# EAGLE design Shruthi-Digital-v01_165 (EAGLE 5.06)
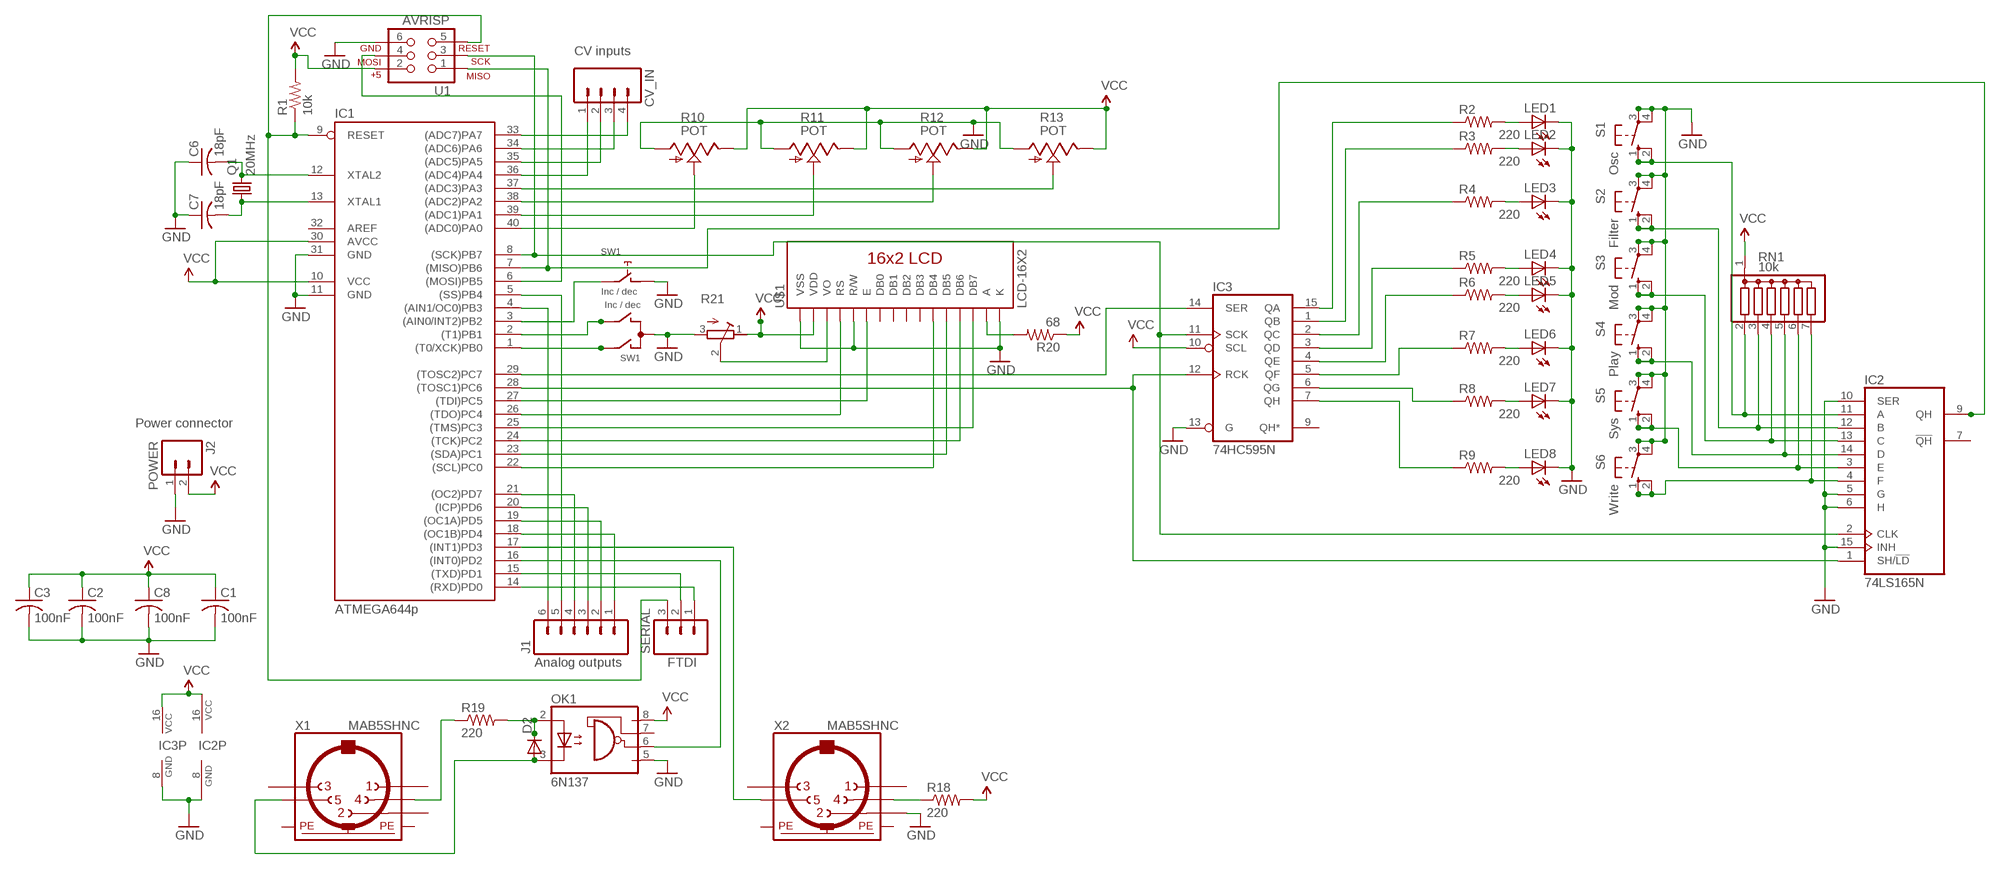
[diagram p0: schematic, sheet 1]

## Parts
C1  100nF  C-US025-024X044  [C025-024X044]
C2  100nF  C-US025-024X044  [C025-024X044]
C3  100nF  C-US025-024X044  [C025-024X044]
C6  18pF  C-US025-024X044  [C025-024X044]
C7  18pF  C-US025-024X044  [C025-024X044]
C8  100nF  C-US025-024X044  [C025-024X044]
CV_IN  M04PTH  [1X04]
D2  1n4148  DIODE1N4148  [DIODE-1N4148]
IC1  ATMEGA644p  MEGA16-P  [DIL40]
IC2  74LS165N  [DIL16]
IC3  74HC595N  [DIL16]
J1  M06SIP  [1X06]
J2  POWER  M02PTH  [1X02]
LED1  LED3MM  [LED3MM]
LED2  LED3MM  [LED3MM]
LED3  LED3MM  [LED3MM]
LED4  LED3MM  [LED3MM]
LED5  LED3MM  [LED3MM]
LED6  LED3MM  [LED3MM]
LED7  LED3MM  [LED3MM]
LED8  LED3MM  [LED3MM]
OK1  6N137  [DIL08]
Q1  20MHz  CRYSTALHC49U-V  [HC49U-V]
R1  10k  R-US_0204/7  [0204/7]
R2  220  R-US_0204/7  [0204/7]
R3  220  R-US_0204/7  [0204/7]
R4  220  R-US_0204/7  [0204/7]
R5  220  R-US_0204/7  [0204/7]
R6  220  R-US_0204/7  [0204/7]
R7  220  R-US_0204/7  [0204/7]
R8  220  R-US_0204/7  [0204/7]
R9  220  R-US_0204/7  [0204/7]
R10  POT  POT_US  [ALPS_POT_SFE]
R11  POT  POT_US  [ALPS_POT_SFE]
R12  POT  POT_US  [ALPS_POT_SFE]
R13  POT  POT_US  [ALPS_POT_SFE]
R18  220  R-US_0204/7  [0204/7]
R19  220  R-US_0204/7  [0204/7]
R20  68  R-US_0204/7  [0204/7]
R21  R-TRIMMT93YA  [RTRIMT93YA]
RN1  10k  G06R  [SIL7]
S1  Osc  40-XX  [B3F-40XX]
S2  Filter  40-XX  [B3F-40XX]
S3  Mod  40-XX  [B3F-40XX]
S4  Play  40-XX  [B3F-40XX]
S5  Sys  40-XX  [B3F-40XX]
S6  Write  40-XX  [B3F-40XX]
SERIAL  M03LOCK  [1X03_LOCK]
SW1  Inc / dec  EC12E_SW  [ALPS_EC12E_SW]
U1  AVRISP  AVR_SPI_PRG_6PTH  [2X3]
U$1  LCD-16X2  [LCD-16X2]
X1  MAB5SHNC  [MAB5SH-NC]
X2  MAB5SHNC  [MAB5SH-NC]

## Nets
GND: C1.2 C2.2 C3.2 C6.1 C7.1 C8.2 IC1.11(GND) IC1.31(GND) IC2.5(G) IC2.6(H) IC2.8(GND) IC2.10(SER) IC2.15(INH) IC3.8(GND) IC3.13(G) J2.1 LED1.K(C) LED2.K(C) LED3.K(C) LED4.K(C) LED5.K(C) LED6.K(C) LED7.K(C) LED8.K(C) OK1.5(GND) R10.P$3(A) R11.P$3(A) R12.P$3(A) R13.P$3(A) R21.3(E) S1.3(P) S1.4(P1) S2.3(P) S2.4(P1) S3.3(P) S3.4(P1) S4.3(P) S4.4(P1) S5.3(P) S5.4(P1) S6.3(P) S6.4(P1) SW1.C SW1.D U1.6 U$1.1(VSS) U$1.5(R/W) U$1.16(K) X2.2
N$1: IC3.2(QC) R4.1
N$3: IC2.4(F) RN1.7 S6.1(S) S6.2(S1)
N$6: IC1.9(RESET) R1.1 SERIAL.3 U1.5
N$8: IC1.8((SCK)PB7) IC2.2(CLK) IC3.11(SCK) U1.3
N$9: IC1.7((MISO)PB6) IC2.9(QH) U1.1
N$10: CV_IN.1 IC1.36((ADC4)PA4)
N$11: CV_IN.2 IC1.35((ADC5)PA5)
N$12: CV_IN.3 IC1.34((ADC6)PA6)
N$13: CV_IN.4 IC1.33((ADC7)PA7)
N$14: IC1.40((ADC0)PA0) R10.P$2(S)
N$15: IC1.39((ADC1)PA1) R11.P$2(S)
N$16: IC1.38((ADC2)PA2) R12.P$2(S)
N$17: IC1.37((ADC3)PA3) R13.P$2(S)
N$18: IC1.4((AIN1/OC0)PB3) J1.6
N$19: IC1.5((SS)PB4) J1.5
N$20: IC1.18((OC1B)PD4) J1.1
N$21: IC1.19((OC1A)PD5) J1.2
N$22: IC1.20((ICP)PD6) J1.3
N$23: IC1.21((OC2)PD7) J1.4
N$24: IC1.14((RXD)PD0) SERIAL.1
N$25: IC1.15((TXD)PD1) SERIAL.2
N$26: IC1.22((SCL)PC0) U$1.11(DB4)
N$27: IC1.26((TDO)PC4) U$1.4(RS)
N$29: IC1.28((TOSC1)PC6) IC2.1(SH/!LD) IC3.12(RCK)
N$30: IC3.15(QA) R2.1
N$31: IC3.1(QB) R3.1
N$33: IC3.3(QD) R5.1
N$34: IC3.4(QE) R6.1
N$35: IC3.5(QF) R7.1
N$36: IC3.7(QH) R9.1
N$37: IC3.6(QG) R8.1
N$42: LED1.A R2.2
N$43: LED2.A R3.2
N$44: LED3.A R4.2
N$45: LED4.A R5.2
N$46: LED5.A R6.2
N$47: LED6.A R7.2
N$48: LED7.A R8.2
N$49: LED8.A R9.2
N$57: IC1.6((MOSI)PB5) U1.4
N$58: IC1.29((TOSC2)PC7) IC3.14(SER)
N$59: IC2.11(A) RN1.2 S1.1(S) S1.2(S1)
N$60: IC2.12(B) RN1.3 S2.1(S) S2.2(S1)
N$61: IC2.13(C) RN1.4 S3.1(S) S3.2(S1)
N$62: IC2.14(D) RN1.5 S4.1(S) S4.2(S1)
N$63: IC2.3(E) RN1.6 S5.1(S) S5.2(S1)
N$64: IC1.1((T0/XCK)PB0) SW1.A
N$65: IC1.2((T1)PB1) SW1.B
N$66: IC1.3((AIN0/INT2)PB2) SW1.E
N$67: D2.C OK1.2(A) R19.2
N$68: R18.1 X2.4
N$69: IC1.17((INT1)PD3) X2.5
N$70: IC1.16((INT0)PD2) OK1.6(VO)
N$71: IC1.23((SDA)PC1) U$1.12(DB5)
N$72: R19.1 X1.4
N$73: D2.A OK1.3(C) X1.5
N$74: IC1.24((TCK)PC2) U$1.13(DB6)
N$75: IC1.25((TMS)PC3) U$1.14(DB7)
N$76: IC1.27((TDI)PC5) U$1.6(E)
N$78: R21.2(S) U$1.3(VO)
N$79: R20.2 U$1.15(A)
N$82: C7.2 IC1.13(XTAL1) Q1.1
N$83: C6.2 IC1.12(XTAL2) Q1.2
VCC: C1.1 C2.1 C3.1 C8.1 IC1.10(VCC) IC1.30(AVCC) IC2.16(VCC) IC3.10(SCL) IC3.16(VCC) J2.2 OK1.8(VCC) R1.2 R10.P$1(E) R11.P$1(E) R12.P$1(E) R13.P$1(E) R18.2 R20.1 R21.1(A) RN1.1 U1.2 U$1.2(VDD)
Unconnected: IC1.32(AREF) IC2.7(!QH) IC3.9(QH*) OK1.7(VE) SW1.GND1(G) SW1.GND2(G) U$1.7(DB0) U$1.8(DB1) U$1.9(DB2) U$1.10(DB3) X1.1 X1.2 X1.3 X2.1 X2.3

## Notes on the sheet
- CV inputs
- Power connector
- Analog outputs | FTDI

## Power pins joined to a net without a drawn wire
PE: X1.PE X1.PE@(PE) X2.PE X2.PE@(PE)

## Library data of the parts
C1-C3 C6-C8 = rcl:C-US: CAPACITOR, American symbol
CV_IN = SparkFun:M04: Header 4 Standard 4-pin 0.1" header. Use with straight break away headers (SKU : PRT-00116), right angle break away headers (PRT-00553), swiss pins (PRT-00743), machine pins (PRT-00117), and female headers (PRT-00115). Molex polarized connector foot print use with SKU : PRT-08231 with associated crimp pins and housings.
D2 = SparkFun:DIODE: Diode These are standard reverse protection diodes and small signal diodes. SMA package can handle up to about 1A. SOD-323 can handle about 200mA. What the SOD-323 package when ordering, there are some mfgs out there that are 5-pin packages.
IC1 = atmel:MEGA16-P: MICROCONTROLLER 16 Kbytes FLASH 1 kbytes SRAM 512 bytes EEPROM USART 8-channel 10 bit ADC Source: avr.lbr
IC2 = 74xx-us:74*165: 8-bit parallel load SHIFT REGISTER
IC3 = 74xx-eu:74*595: 8-bit SHIFT REGISTER, output latch
J1 = SparkFun:M06: Header 6 Standard 6-pin 0.1" header. Use with straight break away headers (SKU : PRT-00116), right angle break away headers (PRT-00553), swiss pins (PRT-00743), machine pins (PRT-00117), and female headers (PRT-00115). Molex polarized connector foot print use with SKU : PRT-08094 with associated crimp pins and housings. NOTES ON THE VARIANTS LOCK and LOCK_LONGPADS... This footprint was designed to help hold the alignment of a through-hole component (i.e. 6-pin header) while soldering it into place. You may notice that each hole has been shifted either up or down by 0.005 of an inch from it's more standard position (which is a perfectly straight line). This slight alteration caused the pins (the squares in the middle) to touch the edges of the holes. Because they are alternating, it causes a "brace" to hold the component in place. 0.005 has proven to be the perfect amount of "off-center" position when using our standard breakaway headers. Although looks a little odd when you look at the bare footprint, once you have a header in there, the alteration is very hard to notice. Also, if you push a header all the way into place, it is covered up entirely on the bottom side. This idea of altering the position of holes to aid alignment will be further integrated into the Sparkfun Library for other footprints. It can help hold any component with 3 or more connection pins.
J2 = SparkFun:M02: Header 2 Standard 2-pin 0.1" header. Use with straight break away headers (SKU : PRT-00116), right angle break away headers (PRT-00553), swiss pins (PRT-00743), machine pins (PRT-00117), and female headers (PRT-00115). Molex polarized connector foot print use with SKU : PRT-08233 with associated crimp pins and housings.
LED1-LED8 = led:LED: LED OSRAM: - CHIPLED LG R971, LG N971, LY N971, LG Q971, LY Q971, LO R971, LY R971 LH N974, LH R974 LS Q976, LO Q976, LY Q976 LO Q996 - Hyper CHIPLED LW Q18S LB Q993, LB Q99A, LB R99A - SideLED LS A670, LO A670, LY A670, LG A670, LP A670 LB A673, LV A673, LT A673, LW A673 LH A674 LY A675 LS A676, LA A676, LO A676, LY A676, LW A676 LS A679, LY A679, LG A679 - Hyper Micro SIDELED® LS Y876, LA Y876, LO Y876, LY Y876 LT Y87S - SmartLED LW L88C, LW L88S LB L89C, LB L89S, LG L890 LS L89K, LO L89K, LY L89K LS L896, LA L896, LO L896, LY L896 - TOPLED LS T670, LO T670, LY T670, LG T670, LP T670 LSG T670, LSP T670, LSY T670, LOP T670, LYG T670 LG T671, LOG T671, LSG T671 LB T673, LV T673, LT T673, LW T673 LH T674 LS T676, LA T676, LO T676, LY T676, LB T676, LH T676, LSB T676, LW T676 LB T67C, LV T67C, LT T67C, LS T67K, LO T67K, LY T67K, LW E67C LS E67B, LA E67B, LO E67B, LY E67B, LB E67C, LV E67C, LT E67C LW T67C LS T679, LY T679, LG T679 LS T770, LO T770, LY T770, LG T770, LP T770 LB T773, LV T773, LT T773, LW T773 LH T774 LS E675, LA E675, LY E675, LS T675 LS T776, LA T776, LO T776, LY T776, LB T776 LHGB T686 LT T68C, LB T68C - Hyper Mini TOPLED® LB M676 - Mini TOPLED Santana® LG M470 LS M47K, LO M47K, LY M47K Source: http://www.osram.convergy.de LUXEON: - LUMILED® LXK2-PW12-R00, LXK2-PW12-S00, LXK2-PW14-U00, LXK2-PW14-V00 LXK2-PM12-R00, LXK2-PM12-S00, LXK2-PM14-U00 LXK2-PE12-Q00, LXK2-PE12-R00, LXK2-PE12-S00, LXK2-PE14-T00, LXK2-PE14-U00 LXK2-PB12-K00, LXK2-PB12-L00, LXK2-PB12-M00, LXK2-PB14-N00, LXK2-PB14-P00, LXK2-PB14-Q00 LXK2-PR12-L00, LXK2-PR12-M00, LXK2-PR14-Q00, LXK2-PR14-R00 LXK2-PD12-Q00, LXK2-PD12-R00, LXK2-PD12-S00 LXK2-PH12-R00, LXK2-PH12-S00 LXK2-PL12-P00, LXK2-PL12-Q00, LXK2-PL12-R00 Source: www.luxeon.com KINGBRIGHT: KA-3528ASYC Source: www.kingbright.com
OK1 = optocoupler:6N137: MOTOROLA OPTO COUPLER
Q1 = crystal:CRYSTAL: CRYSTAL
R1-R9 R18-R20 = rcl:R-US_: RESISTOR, American symbol
R10-R13 = pot-alps:POT_US
R21 = rcl:R-TRIMM: Trimm resistor
RN1 = resistor-sil:G06R: SIL RESISTOR
S1-S6 = switch-omron:40-XX: OMRON SWITCH
SERIAL = SparkFun:M03: Header 3 Standard 3-pin 0.1" header. Use with straight break away headers (SKU : PRT-00116), right angle break away headers (PRT-00553), swiss pins (PRT-00743), machine pins (PRT-00117), and female headers (PRT-00115). Molex polarized connector foot print use with SKU : PRT-08232 with associated crimp pins and housings.
SW1 = switch-alps:EC12E_SW: ALPS rotary Encoder EC12E series with switch
U1 = SparkFun:AVR_SPI_PRG_6: AVR ISP 6 Pin This is the reduced ISP connector for AVR programming. Common on Arduino. This footprint will take up less PCB space and can be used with a 10-pin to 6-pin adapter such as SKU: BOB-08508
U$1 = SparkFun:LCD-16X2
X1 X2 = con-hirschmann:MAB5SH: Female CONNECTOR 5 pins 90 deg. with shield, horizontal (DIN 41524)

## Board
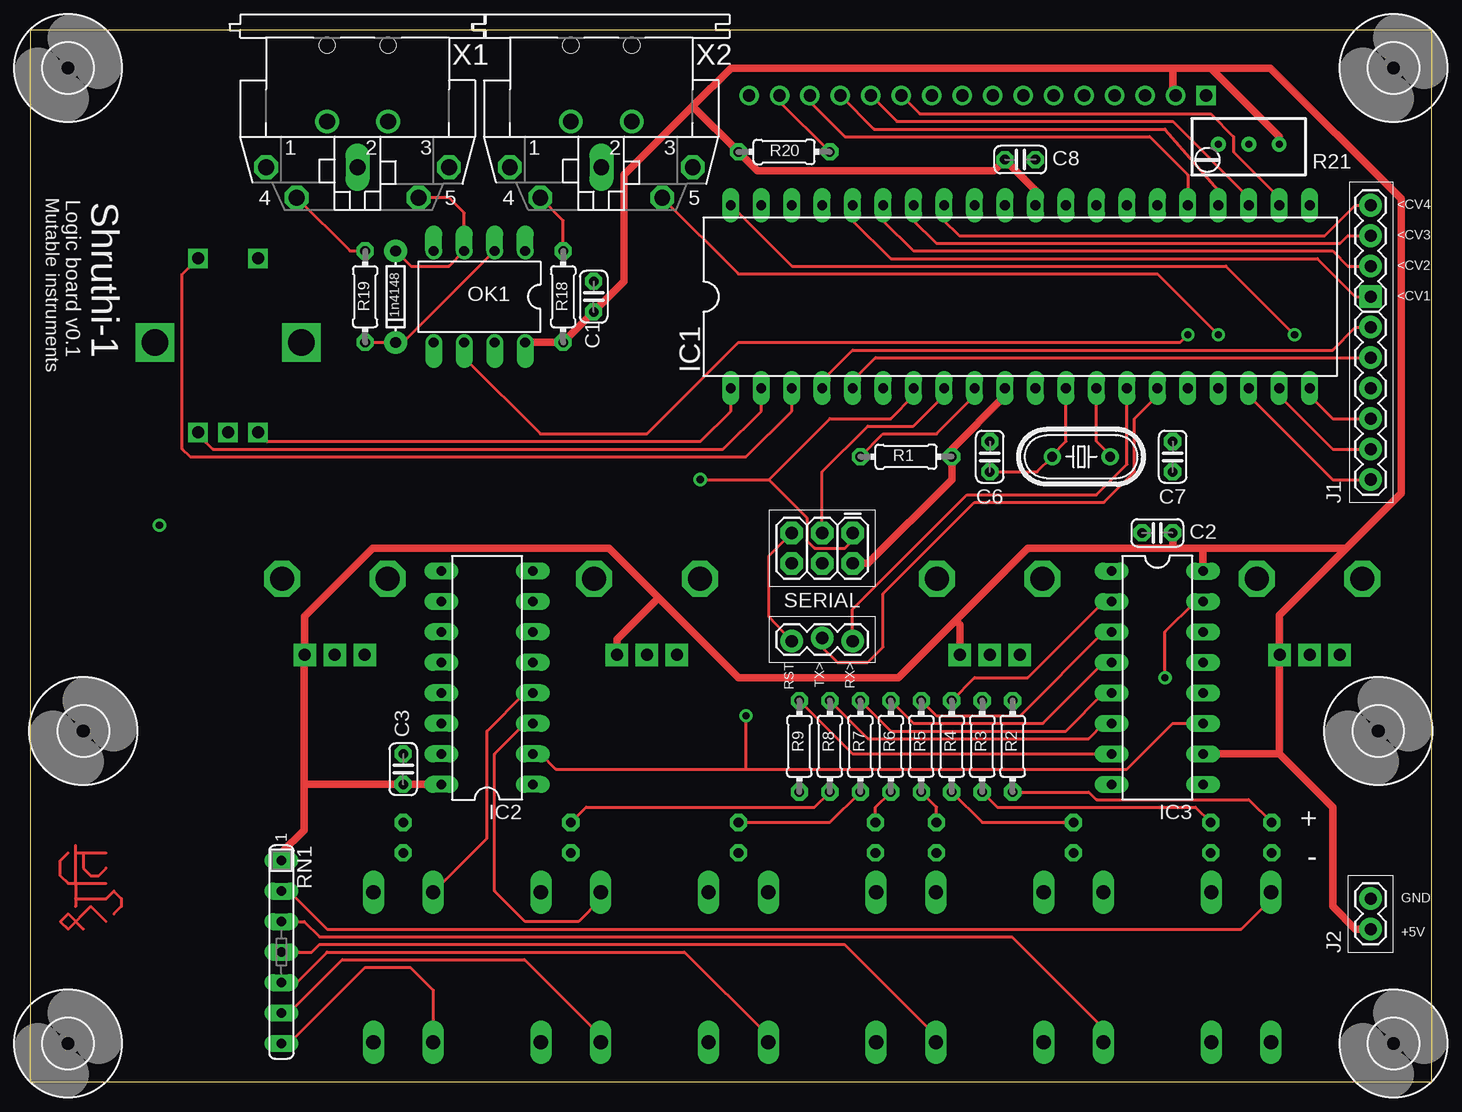
[diagram p1: board, top side]
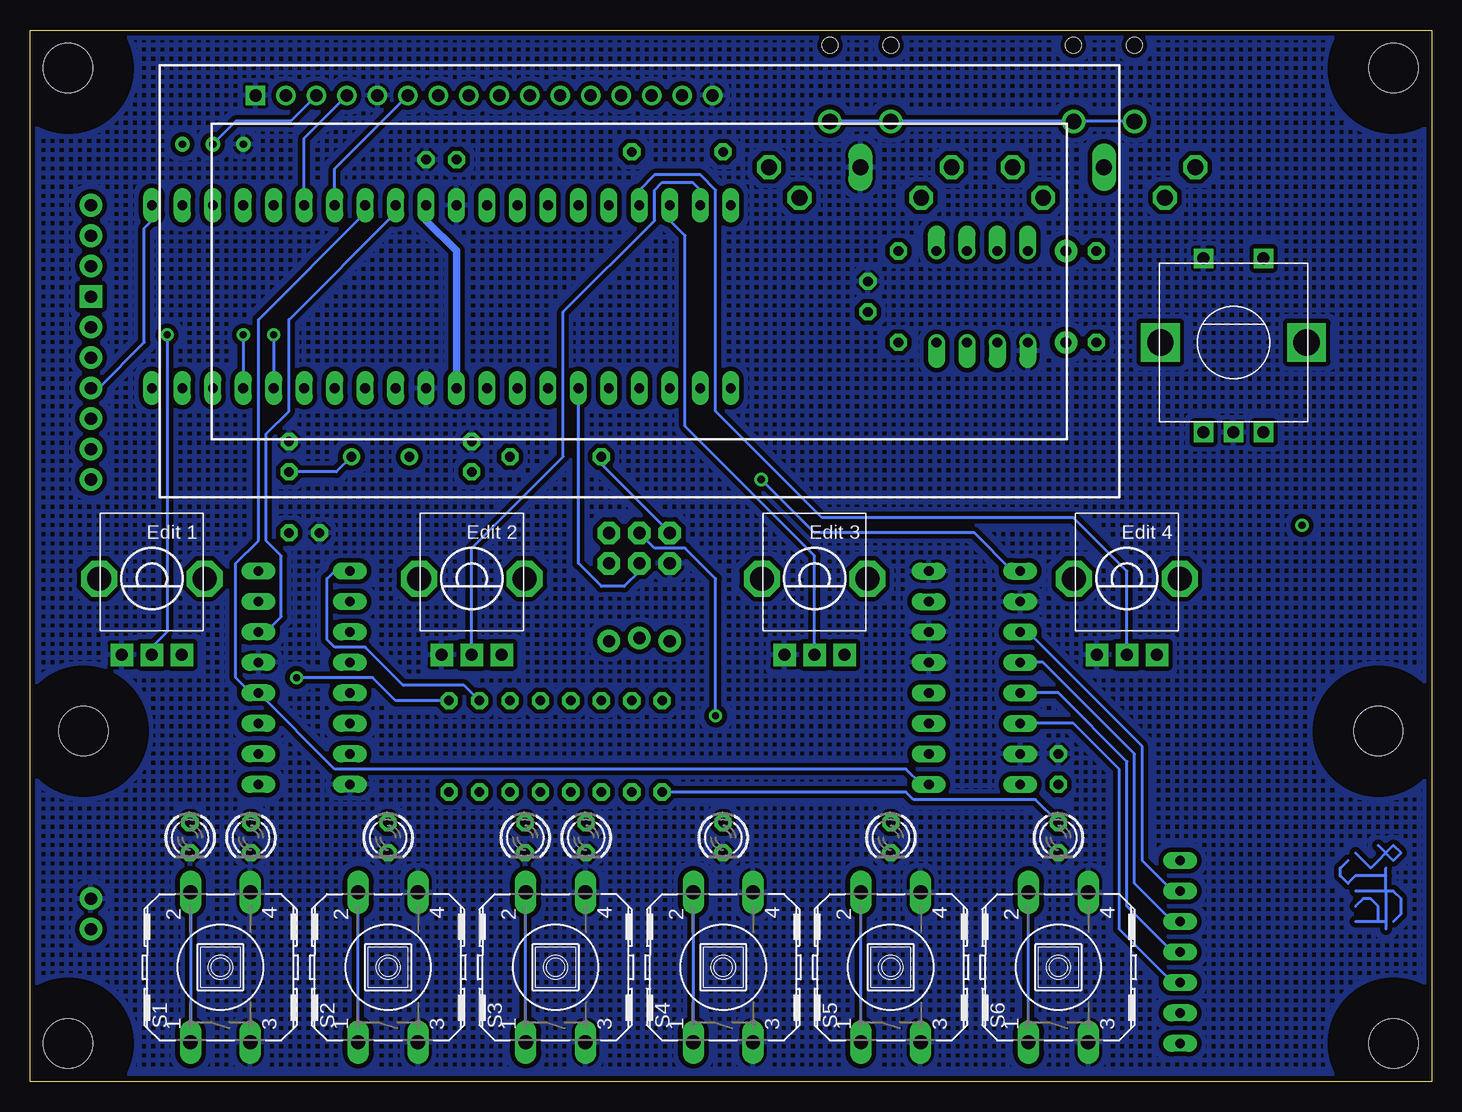
[diagram p2: board, bottom side, seen from below]

Size 116.84 x 87.63 mm. Coordinates in mm from the lower left corner, seen from the top.
Outline: 0,0 116.84,0 116.84,87.63 0,87.62 0,0
Copper layers (1*16): Top 0.035mm / dielectric 1.5mm / Bottom 0.035mm
Design rules "SparkFun": minimum track width 8mil, minimum drill 20mil, track to track 8mil, track to pad 8mil, pad to pad 8mil, via to via 8mil, smd to smd 8mil, copper to edge 10mil, drill to drill 8mil, minimum pad ring 12mil, minimum via ring 10mil, stop-mask expansion 4mil, vias tented up to drill 25mil, thermal gap 10mil

### Footprints (pad centres in the part's own frame; a part is rotated, then mirrored left to right if it is on the bottom)
C025-024X044 = drill 0.813 octagon: 1 -1.27,0; 2 1.27,0
1X04 = drill 1.016 pad 1.88 square: 1 0,0 | drill 1.016 pad 1.88 round: 2 2.54,0; 3 5.08,0; 4 7.62,0
DIODE-1N4148 = drill 0.9 pad 1.88 round: A -3.81,0; C 3.81,0
DIL40 = drill 0.813 long: 1 -24.13,-7.62; 2 -21.59,-7.62; 3 -19.05,-7.62; 4 -16.51,-7.62; 5 -13.97,-7.62; 6 -11.43,-7.62; 7 -8.89,-7.62; 8 -6.35,-7.62; 9 -3.81,-7.62; 10 -1.27,-7.62; 11 1.27,-7.62; 12 3.81,-7.62; 13 6.35,-7.62; 14 8.89,-7.62; 15 11.43,-7.62; 16 13.97,-7.62; 17 16.51,-7.62; 18 19.05,-7.62; 19 21.59,-7.62; 20 24.13,-7.62; 21 24.13,7.62; 22 21.59,7.62; 23 19.05,7.62; 24 16.51,7.62; 25 13.97,7.62; 26 11.43,7.62; 27 8.89,7.62; 28 6.35,7.62; 29 3.81,7.62; 30 1.27,7.62; 31 -1.27,7.62; 32 -3.81,7.62; 33 -6.35,7.62; 34 -8.89,7.62; 35 -11.43,7.62; 36 -13.97,7.62; 37 -16.51,7.62; 38 -19.05,7.62; 39 -21.59,7.62; 40 -24.13,7.62
DIL16 = drill 0.813 long: 1 -8.89,-3.81; 2 -6.35,-3.81; 3 -3.81,-3.81; 4 -1.27,-3.81; 5 1.27,-3.81; 6 3.81,-3.81; 7 6.35,-3.81; 8 8.89,-3.81; 9 8.89,3.81; 10 6.35,3.81; 11 3.81,3.81; 12 1.27,3.81; 13 -1.27,3.81; 14 -3.81,3.81; 15 -6.35,3.81; 16 -8.89,3.81
1X06 = drill 1.016 pad 1.88 round: 1 0,0; 2 2.54,0; 3 5.08,0; 4 7.62,0; 5 10.16,0; 6 12.7,0
1X02 = drill 1.016 pad 1.88 round: 1 0,0; 2 2.54,0
LED3MM = drill 0.813 octagon: A -1.27,0; K 1.27,0
DIL08 = drill 0.813 offset: 1 -3.81,-3.81; 2 -1.27,-3.81; 3 1.27,-3.81; 4 3.81,-3.81; 5 3.81,3.81; 6 1.27,3.81; 7 -1.27,3.81; 8 -3.81,3.81
HC49U-V = drill 0.813 round: 1 -2.413,0; 2 2.413,0
0204/7 = drill 0.813 octagon: 1 -3.81,0; 2 3.81,0
ALPS_POT_SFE = drill 1 pad 1.88 square: P$1 -2.5,6.35; P$2 0,6.35; P$3 2.5,6.35 | drill 2 octagon: P$4 -4.4,0; P$5 4.4,0
RTRIMT93YA = drill 0.61 round: 1 0,-2.54; 2 0,0; 3 0,2.54
SIL7 = drill 0.813 long: 1 -7.62,0; 2 -5.08,0; 3 -2.54,0; 4 0,0; 5 2.54,0; 6 5.08,0; 7 7.62,0
B3F-40XX = drill 1.194 long: 1 -6.248,2.489; 2 6.248,2.489; 3 -6.248,-2.489; 4 6.248,-2.489
1X03_LOCK = drill 1.016 pad 1.88 round: 1 0,0.127; 2 2.54,-0.127; 3 5.08,0.127
ALPS_EC12E_SW = drill 1 square: A -2.5,-7.5; B 2.5,-7.5; C 0,-7.5; D -2.5,7; E 2.5,7 | drill 2.2 square: GND1 -6.1,0; GND2 6.1,0
2X3 = drill 1.016 pad 1.88 octagon: 1 0,0; 2 0,2.54; 3 2.54,0; 4 2.54,2.54; 5 5.08,0; 6 5.08,2.54
LCD-16X2 = drill 1.016 square: 1 -32,15.5 | drill 1.016 round: 2 -29.46,15.5; 3 -26.92,15.5; 4 -24.38,15.5; 5 -21.84,15.5; 6 -19.3,15.5; 7 -16.76,15.5; 8 -14.22,15.5; 9 -11.68,15.5; 10 -9.14,15.5; 11 -6.6,15.5; 12 -4.06,15.5; 13 -1.52,15.5; 14 1.02,15.5; 15 3.56,15.5; 16 6.1,15.5
4,1 = hole 4.1: 0,0
MAB5SH-NC = drill 1.321 octagon: 1 7.62,7.62; 3 -7.62,7.62; 4 5.08,10.16; 5 -5.08,10.16 | drill 1.321 long: 2 0,7.62 | drill 1.321 round: PE -2.54,3.81; PE@ 2.54,3.81 | hole 1.321: -2.54,-2.54; 2.54,-2.54

### Placement (x,y rotation side)
C1  46.99,65.41 90 top
C2  93.98,45.72 180 top
C3  31.11,26.04 90 top
C6  80.01,52.07 270 top
C7  95.25,52.07 270 top
C8  82.55,76.84 0 top
CV_IN  111.76,65.41 90 top
D2  30.48,65.41 270 top
IC1  82.55,65.41 0 top
IC2  38.1,33.66 90 top
IC3  93.98,33.66 270 top
J1  111.76,50.16 90 top
J2  111.76,15.24 270 top
LED1  103.5,20.32 270 bottom
LED2  98.42,20.32 270 bottom
LED3  86.99,20.32 270 bottom
LED4  75.56,20.32 270 bottom
LED5  70.48,20.32 270 bottom
LED6  59.06,20.32 270 bottom
LED7  45.08,20.32 270 bottom
LED8  31.11,20.32 270 bottom
OK1  37.47,65.41 180 top
Q1  87.63,52.07 180 top
R1  73.03,52.07 0 top
R2  81.91,27.94 270 top
R3  79.38,27.94 270 top
R4  76.83,27.94 270 top
R5  74.3,27.94 270 top
R6  71.75,27.94 270 top
R7  69.22,27.94 270 top
R8  66.67,27.94 270 top
R9  64.14,27.94 270 top
R10  106.68,41.91 180 bottom
R11  80.01,41.91 180 bottom
R12  51.44,41.91 180 bottom
R13  25.4,41.91 180 bottom
R18  44.45,65.41 270 top
R19  27.94,65.41 270 top
R20  62.86,77.47 0 top
R21  101.6,78.11 90 top
RN1  20.95,10.8 270 top
S1  100.97,9.53 90 bottom
S2  86.99,9.53 90 bottom
S3  73.03,9.53 90 bottom
S4  59.06,9.53 90 bottom
S5  45.08,9.53 90 bottom
S6  31.11,9.53 90 bottom
SERIAL  68.58,36.83 180 top
SW1  16.51,61.59 0 bottom
U1  68.58,45.72 180 top
U$1  66.04,66.68 0 bottom
U$2  [4,1]  113.66,84.46 0 top
U$3  [4,1]  113.66,3.17 0 top
U$4  [4,1]  3.17,3.17 0 top
U$5  [4,1]  3.17,84.46 0 top
U$6  [4,1]  4.45,29.21 0 top
U$7  [4,1]  112.39,29.21 0 top
X1  27.3,83.82 180 top
X2  47.62,83.82 180 top

### Tracks (layer width: path | path; a pad name or v marks a point on that pad's centre or on a via)
GND
  pour Bottom (isolate 0.381, hatched): 0.63,87 0.63,0.64 116.2,0.64 116.2,87
N$1
  Top 0.254: IC3.2 89.53,40.01 83.19,33.66 78.74,33.66 R4.1
N$3
  Top 0.254: RN1.7 21.59,3.17 27.94,9.53 31.7,9.53 33.6,7.62 S6.1 | IC2.4 41.27,32.38 38.1,29.21 38.1,20.27 S6.2
  Bottom 0.254: S6.1 S6.2
N$4
  Bottom 0.254: 6.35,19.05 5.08,17.78 3.17,19.68 2.54,19.05 3.17,18.41 4.45,19.68
N$6
  Top 0.254: U1.5 61.59,43.81 61.59,38.73 SERIAL.3 | R1.1 71.12,53.98 75.56,53.98 78.74,57.15 IC1.9
  Bottom 0.254: U1.5 69.22,51.44 R1.1
N$8  (via drill 0.6)
  Top 0.254: U1.3 66.04,50.8 69.85,54.61 73.66,54.61 76.2,57.15 IC1.8 | IC3.11 95.25,29.84 91.44,26.04 59.69,26.04 | 59.69,26.04 43.81,26.04 42.55,27.3 IC2.2 | 59.69,26.04 v59.69,30.48
  Bottom 0.254: U1.3 64.77,44.45 62.23,44.45 59.69,41.91 v59.69,30.48
N$9  (via drill 0.6)
  Top 0.254: 61.59,50.16 64.77,46.99 64.77,45.09 65.41,44.45 67.94,44.45 68.58,45.09 U1.1 | IC1.7 73.66,57.15 71.75,55.24 66.67,55.24 61.59,50.16 | v55.88,50.16 61.59,50.16
  Bottom 0.254: IC2.9 34.92,42.55 38.1,45.72 51.44,45.72 v55.88,50.16
N$10
  Top 0.254: IC1.36 68.58,71.76 71.75,68.58 107.31,68.58 110.49,65.41 CV_IN.1
N$11
  Top 0.254: IC1.35 71.12,71.76 73.66,69.22 108.58,69.22 109.85,67.95 CV_IN.2
N$12
  Top 0.254: IC1.34 73.66,71.76 75.56,69.85 109.22,69.85 109.85,70.48 CV_IN.3
N$13
  Top 0.254: IC1.33 76.2,71.76 77.47,70.48 107.95,70.48 110.49,73.03 CV_IN.4
N$14  (via drill 0.6)
  Top 0.254: IC1.40 63.5,67.95 99.69,67.95 v105.41,62.23
  Bottom 0.254: v105.41,62.23 105.41,37.46 106.68,36.2 R10.P$2
N$15
  Bottom 0.254: IC1.39 60.96,74.3 61.59,74.93 64.14,74.93 64.77,74.3 64.77,71.76 72.39,64.14 72.39,52.07 80.01,44.45 R11.P$2
N$16
  Bottom 0.254: IC1.38 63.5,71.76 62.23,70.48 62.23,54.61 51.44,43.81 R12.P$2
N$17
  Bottom 0.254: R13.P$2 25.4,42.55 29.84,46.99 50.8,46.99 59.69,55.88 59.69,74.3 60.96,75.57 64.77,75.57 66.04,74.3 IC1.37
N$18
  Top 0.254: IC1.4 66.04,58.42 68.58,60.96 108.58,60.96 110.49,62.87 J1.6
N$19
  Top 0.254: IC1.5 68.58,58.42 70.48,60.32 J1.5
N$20
  Top 0.254: IC1.18 101.6,57.15 108.58,50.16 J1.1
N$21
  Top 0.254: IC1.19 104.14,57.15 108.58,52.7 J1.2
N$22
  Top 0.254: IC1.20 106.68,57.15 108.58,55.24 J1.3
N$23
  Bottom 0.254: IC1.21 106.68,71.76 107.31,71.12 107.31,61.59 111.12,57.78 J1.4
N$24
  Top 0.254: SERIAL.1 68.58,39.37 78.1,48.89 88.9,48.89 91.44,51.44 IC1.14
N$25
  Top 0.254: SERIAL.2 66.04,36.2 67.31,34.92 69.85,34.92 71.12,36.2 71.12,40.64 78.74,48.26 89.53,48.26 92.08,50.8 92.08,55.24 93.98,57.15 IC1.15
N$26
  Top 0.254: U$1.11 74.17,80.65 98.42,80.65 100.33,78.74 100.33,77.47 104.14,73.66 IC1.22
N$27
  Bottom 0.254: U$1.4 93.98,78.62 IC1.26
N$29
  Bottom 0.254: IC1.28 88.9,72.39 97.79,63.5 97.79,45.09 99.69,43.18 99.69,33.66 98.42,32.38 IC3.12 91.44,26.04 43.81,26.04 42.55,24.77 IC2.1
N$30  (via drill 0.6)
  Top 0.254: v94.61,33.66 94.61,37.46 97.16,40.01 IC3.15
  Bottom 0.254: R2.1 86.36,31.75 88.27,33.66 v94.61,33.66
N$31
  Bottom 0.254: R3.1 80.64,33.02 85.72,33.02 88.9,36.2 91.44,36.2 92.08,36.83 92.08,41.91 91.44,42.55 IC3.1
N$33
  Top 0.254: R5.1 75.56,30.48 82.55,30.48 89.53,37.46 IC3.3
N$34
  Top 0.254: R6.1 73.66,29.84 84.45,29.84 89.53,34.92 IC3.4
N$35
  Top 0.254: R7.1 71.75,29.21 86.36,29.21 89.53,32.38 IC3.5
N$36
  Top 0.254: IC3.7 68.58,27.3 R9.1
N$37
  Top 0.254: R8.1 69.85,28.57 88.27,28.57 89.53,29.84 IC3.6
N$42
  Top 0.254: R2.2 88.27,24.13 88.9,23.49 101.6,23.49 LED1.A
N$43
  Top 0.254: R3.2 80.64,22.86 97.16,22.86 LED2.A
N$44
  Top 0.254: R4.2 79.38,21.59 LED3.A
N$45
  Top 0.254: R5.2 75.56,22.86 LED4.A
N$46
  Top 0.254: R6.2 70.48,22.86 LED5.A
N$47
  Top 0.254: R7.2 66.67,21.59 LED6.A
N$48
  Top 0.254: R8.2 65.41,22.86 46.36,22.86 LED7.A
N$49
  Bottom 0.254: R9.2 43.81,24.13 43.18,23.49 33.02,23.49 LED8.A
N$52
  Bottom 0.254: 3.81,17.14 3.81,17.78 | 3.81,15.88 3.81,17.14 | 3.81,15.88 3.81,13.34 | 3.81,13.34 3.81,12.7 | 4.45,13.34 6.35,13.34 | 3.81,13.34 4.45,13.34 | 4.45,13.34 4.45,14.61 5.08,15.24 5.71,15.24 6.35,14.61 | 3.81,17.14 6.35,17.14 6.99,16.51 7.62,17.14 7.62,17.78 6.99,18.41 | 3.81,15.88 6.35,15.88 | 3.81,15.88 3.17,15.88 2.54,15.24 2.54,13.97 3.17,13.34
N$53
  Top 0.254: 6.35,13.34 5.08,14.61 3.17,12.7 2.54,13.34 3.17,13.97 4.45,12.7
N$54
  Top 0.254: 3.81,15.24 3.81,14.61 | 3.81,16.51 3.81,15.24 | 3.81,16.51 3.81,19.05 | 3.81,19.05 3.81,19.68 | 4.45,19.05 6.35,19.05 | 3.81,19.05 4.45,19.05 | 4.45,19.05 4.45,17.78 5.08,17.14 5.71,17.14 6.35,17.78 | 3.81,15.24 6.35,15.24 6.99,15.88 7.62,15.24 7.62,14.61 6.99,13.97 | 3.81,16.51 6.35,16.51 | 3.81,16.51 3.17,16.51 2.54,17.14 2.54,18.41 3.17,19.05
N$56  (via drill 0.6)
  other vias: 10.79,46.35
N$57
  Bottom 0.254: IC1.6 71.12,43.18 69.22,41.27 67.31,41.27 66.04,42.55 U1.4
N$58
  Bottom 0.254: IC1.29 86.36,72.39 95.25,63.5 95.25,55.88 97.16,53.98 97.16,45.09 95.88,43.81 95.88,38.73 97.16,37.46 IC3.14
N$59
  Top 0.254: S1.2 103.45,15.29 103.5,15.24 100.97,12.7 24.77,12.7 21.59,15.88 RN1.2
  Bottom 0.203: S1.1 102.87,3.17
  Bottom 0.254: 102.87,3.17 102.87,3.23 | S1.2 S1.1 | IC2.11 33.66,37.46 24.13,27.94 24.13,18.41 21.59,15.88 RN1.2
N$60
  Top 0.254: RN1.3 22.86,13.34 24.13,12.07 81.86,12.07 89.48,4.45 S2.1
  Bottom 0.254: S2.1 S2.2 | IC2.12 32.39,34.92 24.77,27.3 24.77,16.51 21.59,13.34 RN1.3
N$61
  Top 0.254: RN1.4 23.5,10.8 24.13,11.43 67.89,11.43 75.51,3.81 S3.1
  Bottom 0.254: S3.1 S3.2 | IC2.13 31.11,32.38 25.4,26.67 25.4,14.61 21.59,10.8 RN1.4
N$62
  Top 0.254: RN1.5 22.23,8.25 24.77,10.8 54.56,10.8 61.54,3.81 S4.1
  Bottom 0.254: S4.1 S4.2 | IC2.14 29.84,29.84 26.04,26.04 26.04,12.7 21.59,8.25 RN1.5
N$63
  Top 0.254: RN1.6 21.59,5.71 26.04,10.16 41.22,10.16 47.57,3.81 S5.1 | IC2.3 41.27,29.84 38.73,27.3 38.73,15.88 41.27,13.34 45.72,13.34 47.57,15.19 S5.2
  Bottom 0.254: S5.1 S5.2
N$64
  Top 0.254: SW1.A 19.77,53.34 55.88,53.34 58.42,55.88 IC1.1
N$65
  Top 0.254: SW1.B 13.97,54.05 13.97,53.98 15.24,52.7 57.78,52.7 60.96,55.88 IC1.2
N$66
  Top 0.254: 13.97,68.56 SW1.E 12.72,67.31 12.7,67.31 12.7,52.7 13.34,52.07 59.69,52.07 63.5,55.88 IC1.3
N$67
  Top 0.254: R19.2 D2.C 31.11,61.59 OK1.2
N$68
  Top 0.254: X2.4 44.45,71.76 R18.1
N$69  (via drill 0.6)
  Top 0.254: X2.5 59.06,67.31 93.98,67.31 v99.06,62.23
  Bottom 0.254: v99.06,62.23 IC1.17
N$70  (via drill 0.6)
  Top 0.254: v96.52,62.23 95.88,61.59 59.06,61.59 51.44,53.98 42.55,53.98 36.2,60.32 OK1.6
  Bottom 0.254: v96.52,62.23 IC1.16
N$71
  Top 0.254: U$1.12 72.27,80.01 95.25,80.01 101.6,73.66 IC1.23
N$72
  Top 0.254: X1.4 26.67,69.22 R19.1
N$73
  Top 0.254: D2.A 31.75,67.95 34.92,67.95 OK1.3 36.2,72.39 34.92,73.66 X1.5
N$74
  Top 0.254: U$1.13 70.36,79.38 94.61,79.38 99.06,74.3 IC1.24
N$75
  Top 0.254: U$1.14 64.77,81.93 64.77,81.92 67.94,78.74 93.34,78.74 96.52,75.57 IC1.25
N$76
  Bottom 0.254: U$1.6 91.44,76.08 IC1.27
N$78
  Bottom 0.254: U$1.3 95.12,80.01 99.69,80.01 R21.2
N$79
  Top 0.254: R20.2 62.48,81.67 U$1.15
N$82
  Top 0.254: IC1.13 88.9,53.34 90.04,52.2 Q1.1
  Bottom 0.254: Q1.1 91.31,50.8 C7.2
N$83
  Top 0.254: IC1.12 86.36,53.34 85.22,52.2 Q1.2 83.95,50.8 C6.2
PE
  Bottom 0.254: X1.PE@ X1.PE X2.PE@ X2.PE
VCC
  Top 0.254: 95.25,82.18 U$1.2
  Top 0.61: IC1.30 83.82,74.3 C8.1 80.34,75.9 60.63,75.9 R20.1 55.25,81.28 | 98.42,84.46 95.25,84.46 | 98.42,84.46 104.14,78.74 R21.1 | 95.25,84.46 95.25,82.18 | IC1.10 81.28,57.15 76.83,52.7 R1.2 76.83,50.16 69.85,43.18 U1.2 | 95.25,84.46 58.42,84.46 55.25,81.28 | 104.14,27.3 108.58,22.86 108.58,14.61 110.49,12.7 J2.2 | 104.14,27.3 IC3.10 | 104.14,27.3 104.14,35.52 R10.P$1 104.14,35.6 104.14,38.87 109.72,44.45 | OK1.8 R18.2 C1.1 49.53,66.68 49.53,75.57 55.25,81.28 | 95.25,44.45 83.19,44.45 77.15,38.42 | 95.25,44.45 97.79,44.45 | 97.79,44.45 109.72,44.45 | 109.72,44.45 114.3,49.03 114.3,73.56 103.4,84.46 98.42,84.46 | 77.15,38.42 72.39,33.66 59.06,33.66 52.39,40.32 | R11.P$1 77.51,38.06 77.15,38.42 | 52.39,40.32 48.26,44.45 28.57,44.45 22.9,38.77 R13.P$1 22.86,35.56 22.86,24.77 | R12.P$1 48.94,36.87 52.39,40.32 | 97.79,44.45 IC3.16 | 22.86,24.77 22.86,20.95 20.95,19.05 RN1.1 | 22.86,24.77 C3.1 IC2.16 | 95.25,44.45 C2.1
  Bottom 0.61: IC1.30 83.82,71.76 81.28,69.22 IC1.10

### Text on the board
tPlace: <CV4 | <CV3 | <CV2 | <CV1 | RST | TX> | RX> | + | - | GND | +5V
bPlace: Edit 4 | Edit 3 | Edit 2 | Edit 1
tNames: Mutable instruments | Logic board v0.1 | Shruthi-1